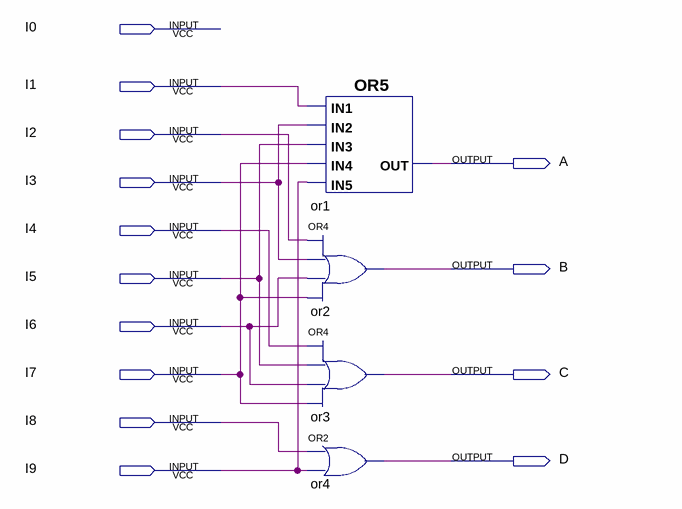
[diagram p0: schematic sheet]
// Quartus schematic Ten_line_to_four_line_BCD_encoder.bdf as structural Verilog: 4 symbols, 14 pins
module Ten_line_to_four_line_BCD_encoder (
  input  I0,
  input  I1,
  input  I2,
  input  I3,
  input  I4,
  input  I5,
  input  I6,
  input  I7,
  input  I8,
  input  I9,
  output A,
  output B,
  output C,
  output D
);

  or or1 (A, I1, I3, I5, I7, I9);
  or or2 (B, I2, I3, I6, I7);
  or or3 (C, I4, I5, I6, I7);
  or or4 (D, I8, I9);
endmodule
